# EAGLE design LED-mini35-SHIM (EAGLE 9.6.2)
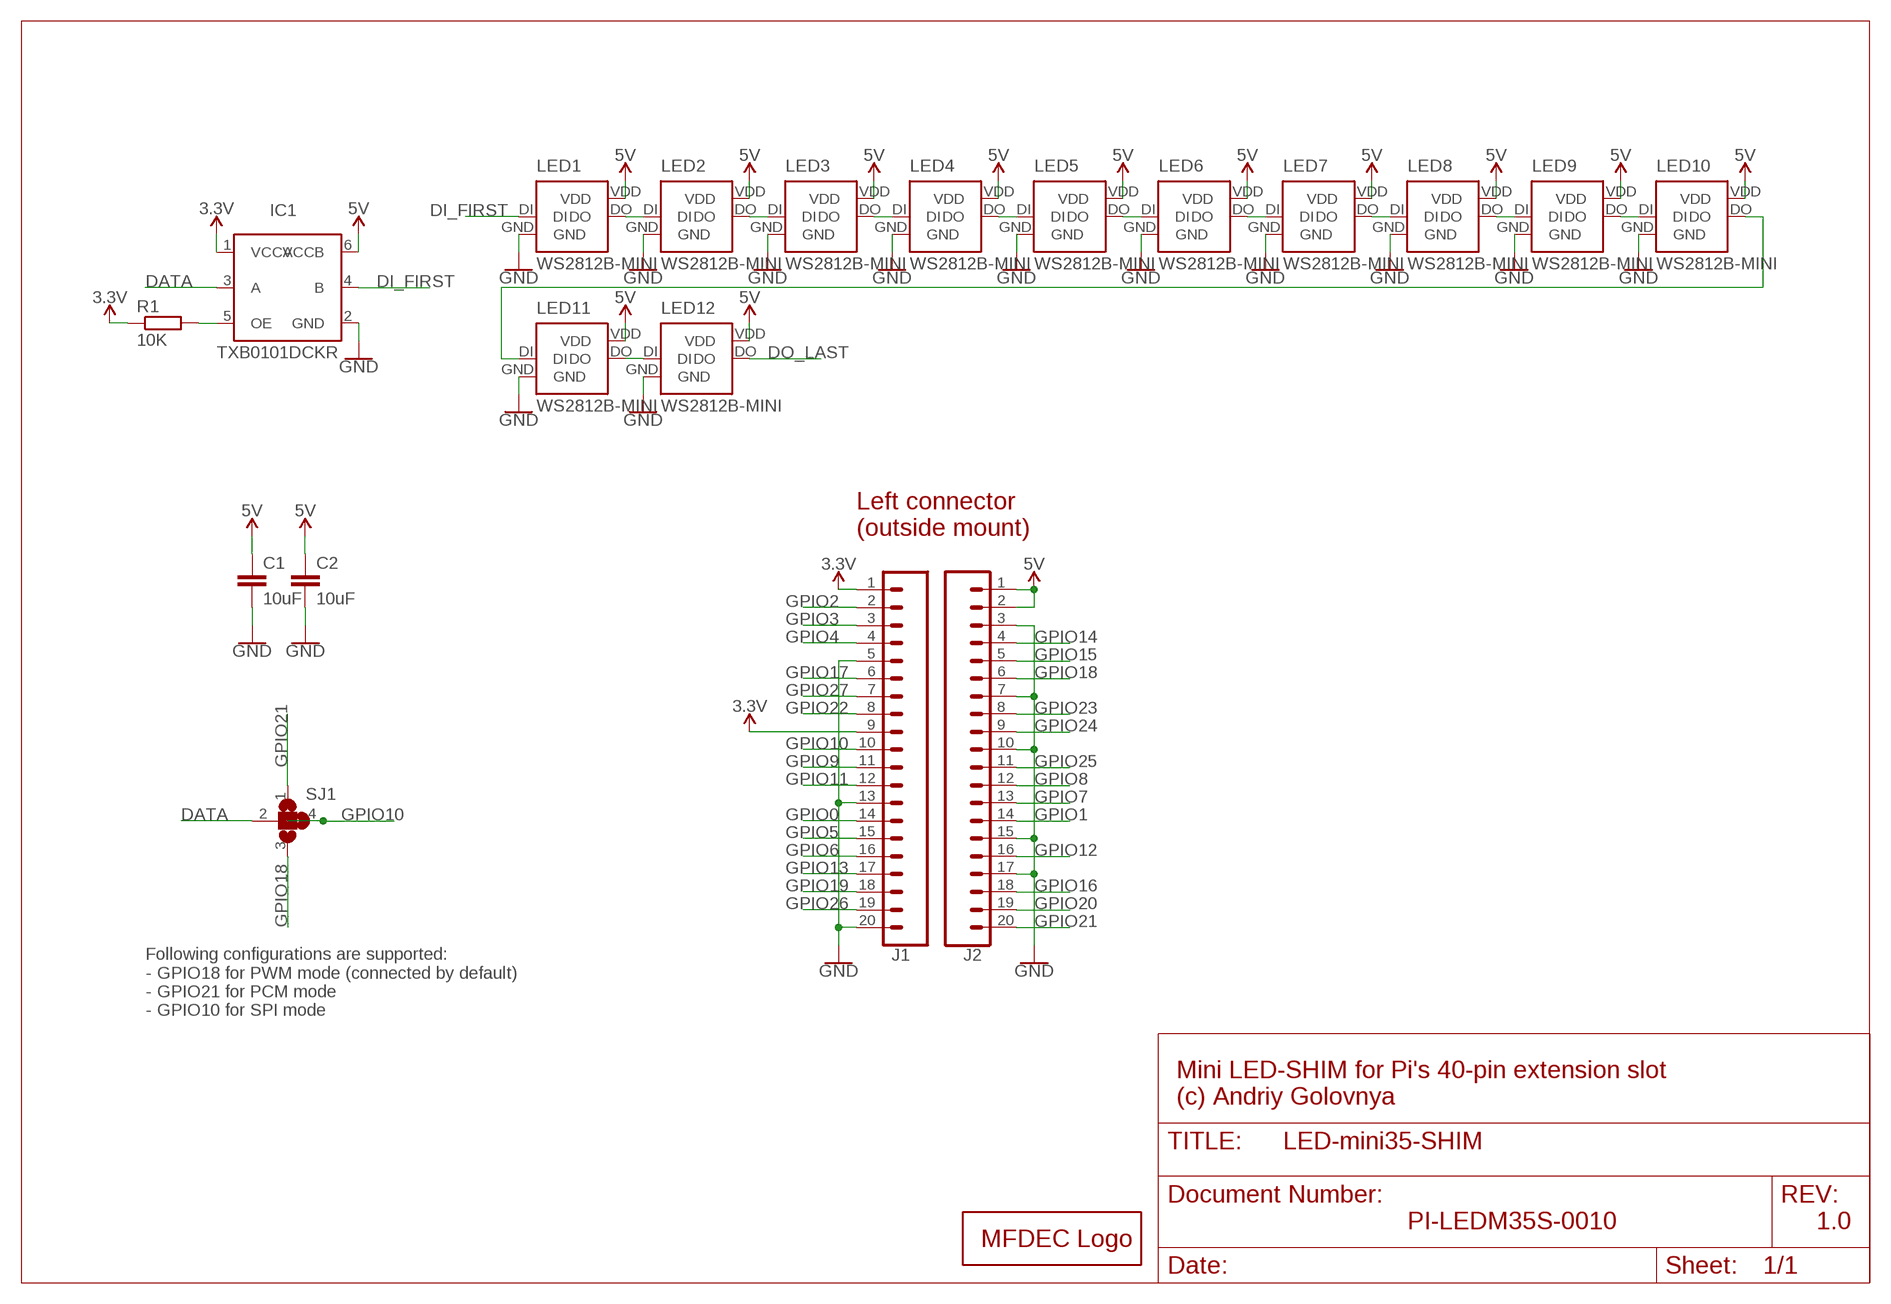
[diagram p0: schematic, sheet 1]

## Parts
C1  10uF  C-EUC0805  [C0805]
C2  10uF  C-EUC0805  [C0805]
IC1  TXB0101DCKR  [SOT65P210X110-6N]
J1  CONN_20LOCK  [1X20_LOCK]
J2  CONN_20LOCK  [1X20_LOCK]
LED1  WS2812B-MINI  [WS2812X-MINI]
LED2  WS2812B-MINI  [WS2812X-MINI]
LED3  WS2812B-MINI  [WS2812X-MINI]
LED4  WS2812B-MINI  [WS2812X-MINI]
LED5  WS2812B-MINI  [WS2812X-MINI]
LED6  WS2812B-MINI  [WS2812X-MINI]
LED7  WS2812B-MINI  [WS2812X-MINI]
LED8  WS2812B-MINI  [WS2812X-MINI]
LED9  WS2812B-MINI  [WS2812X-MINI]
LED10  WS2812B-MINI  [WS2812X-MINI]
LED11  WS2812B-MINI  [WS2812X-MINI]
LED12  WS2812B-MINI  [WS2812X-MINI]
LOGO1  MFDECLOGO_L_10MM  [MFDEC_L_10MM]
R1  10K  R-EU_R0402  [R0402]
SJ1  SJ3  [SJ_3]

## Nets
3.3V: IC1.1(VCCA) J1.1 J1.9 R1.1
5V: C1.1 C2.1 IC1.6(VCCB) J2.1 J2.2 LED1.VDD LED2.VDD LED3.VDD LED4.VDD LED5.VDD LED6.VDD LED7.VDD LED8.VDD LED9.VDD LED10.VDD LED11.VDD LED12.VDD
DATA: IC1.3(A) SJ1.2
DI_FIRST: IC1.4(B) LED1.DI
DO_LAST: LED12.DO
GND: C1.2 C2.2 IC1.2(GND) J1.5 J1.13 J1.20 J2.3 J2.7 J2.10 J2.15 J2.17 LED1.GND LED2.GND LED3.GND LED4.GND LED5.GND LED6.GND LED7.GND LED8.GND LED9.GND LED10.GND LED11.GND LED12.GND
GPIO0: J1.14
GPIO1: J2.14
GPIO2: J1.2
GPIO3: J1.3
GPIO4: J1.4
GPIO5: J1.15
GPIO6: J1.16
GPIO7: J2.13
GPIO8: J2.12
GPIO9: J1.11
GPIO10: J1.10 SJ1.4
GPIO11: J1.12
GPIO12: J2.16
GPIO13: J1.17
GPIO14: J2.4
GPIO15: J2.5
GPIO16: J2.18
GPIO17: J1.6
GPIO18: J2.6 SJ1.3
GPIO19: J1.18
GPIO20: J2.19
GPIO21: J2.20 SJ1.1
GPIO22: J1.8
GPIO23: J2.8
GPIO24: J2.9
GPIO25: J2.11
GPIO26: J1.19
GPIO27: J1.7
N$1: LED1.DO LED2.DI
N$2: LED2.DO LED3.DI
N$3: LED3.DO LED4.DI
N$4: LED4.DO LED5.DI
N$5: LED5.DO LED6.DI
N$6: LED6.DO LED7.DI
N$7: LED7.DO LED8.DI
N$8: LED8.DO LED9.DI
N$9: LED9.DO LED10.DI
N$10: LED10.DO LED11.DI
N$11: LED11.DO LED12.DI
N$143: IC1.5(OE) R1.2

## Notes on the sheet
- Left connector
  (outside mount)
- Following configurations are supported:
  - GPIO18 for PWM mode (connected by default)
  - GPIO21 for PCM mode
  - GPIO10 for SPI mode
- Mini LED-SHIM for Pi's 40-pin extension slot
  (c) Andriy Golovnya
- PI-LEDM35S-0010 | 1.0

## Library data of the parts
C1 C2 = rcl:C-EU: CAPACITOR, European symbol; SPICEPREFIX: C
IC1 = TXB0101DCKR:TXB0101DCKR
J1 J2 = _my_locked_connectors:CONN_20: Multi connection point. Often used as Generic Header-pin footprint for 0.1 inch spaced/style header connections On any of the 0.1 inch spaced packages, you can populate with these: Break Away Headers - Straight <https://www.sparkfun.com/products/116> (PRT-00116) Break Away Male Headers - Right Angle <https://www.sparkfun.com/products/553> (PRT-00553) Female Headers <https://www.sparkfun.com/products/115> (PRT-00115) Break Away Headers - Machine Pin <https://www.sparkfun.com/products/117> (PRT-00117) Break Away Female Headers - Swiss Machine Pin <https://www.sparkfun.com/products/743> (PRT-00743) For SCREWTERMINALS and SPRING TERMINALS visit here: Screw Terimnals on SparkFun.com <https://www.sparkfun.com/search/results?term=Screw+Terminals> (5mm/3.5mm/2.54mm spacing) This device is also useful as a general connection point to wire up your design to another part of your project. Our various solder wires solder well into these plated through hole pads. Hook-Up Wire - Assortment (Stranded, 22 AWG) <https://www.sparkfun.com/products/11375> (PRT-11375) Hook-Up Wire - Assortment (Solid Core, 22 AWG) <https://www.sparkfun.com/products/11367> (PRT-11367) View the entire wire category on our website here <https://www.sparkfun.com/categories/141> Special notes: Molex polarized connector foot print use with SKU : PRT-08231 with associated crimp pins and housings. 1MM SMD Version SKU: PRT-10208 NOTES ON THE VARIANTS LOCK and LOCK_LONGPADS... This footprint was designed to help hold the alignment of a through-hole component (i.e. 6-pin header) while soldering it into place. You may notice that each hole has been shifted either up or down by 0.005 of an inch from it's more standard position (which is a perfectly straight line). This slight alteration caused the pins (the squares in the middle) to touch the edges of the holes. Because they are alternating, it causes a "brace" to hold the component in place. 0.005 has proven to be the perfect amount of "off-center" position when using our standard breakaway headers. Although looks a little odd when you look at the bare footprint, once you have a header in there, the alteration is very hard to notice. Also,if you push a header all the way into place, it is covered up entirely on the bottom side. Note about LOCK SPECIAL package: This is just like the LOCK variant in that the holes are staggared by 5 mil, but except for the last two holes. They are not altered from the "standard" footprint layout. This is used for a special purpose on the layout of our Graphic LCD Backpack. Make sure you want to use this device before selecting it for you project!
LED1-LED12 = WS281X:WS2812: WS2812 RGB LED
LOGO1 = _my_logos:MFDECLOGO: Midnight Fog - Digital Eye Candy LOGO
R1 = rcl:R-EU_: RESISTOR, European symbol; SPICEPREFIX: R
SJ1 = _my_jumpers:SJ3: SMD solder JUMPER SJ3 - simple jumper SJ3FI - fancy inside jumper SJ3FO - fancy outside jumper SJ3W - wide jumper

## Board
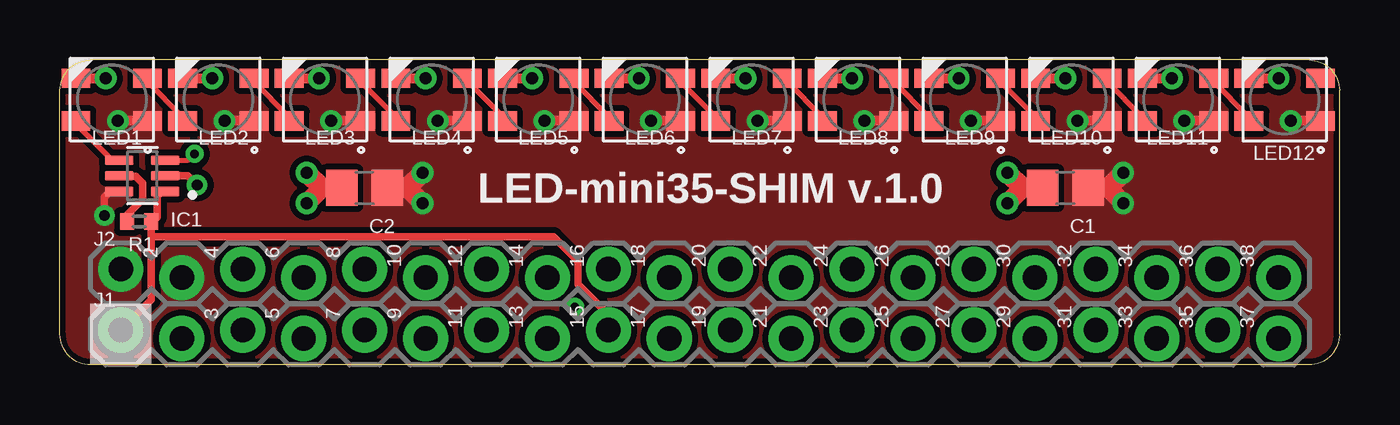
[diagram p1: board, top side]
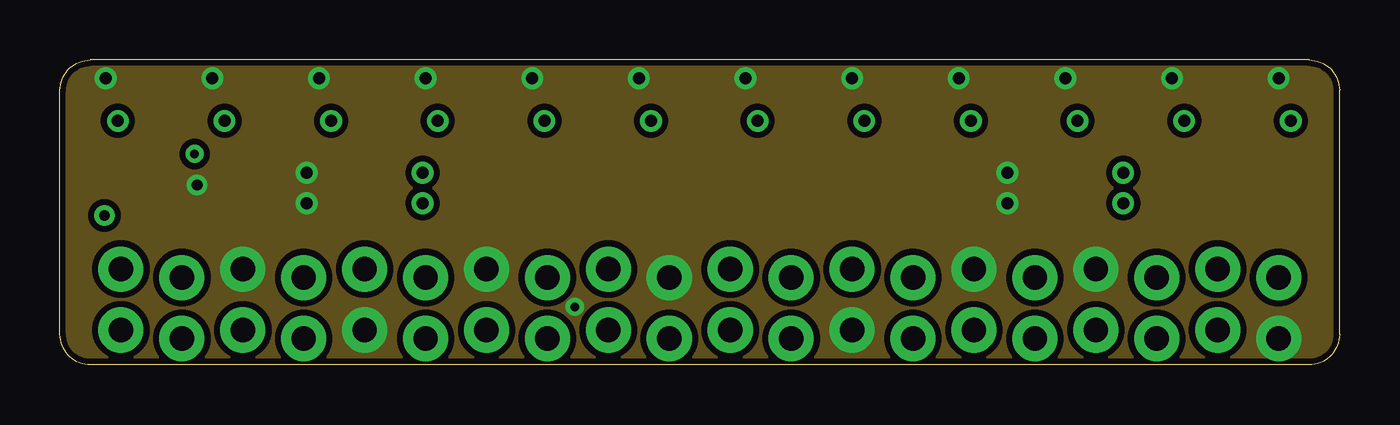
[diagram p2: board, inner layer Route2]
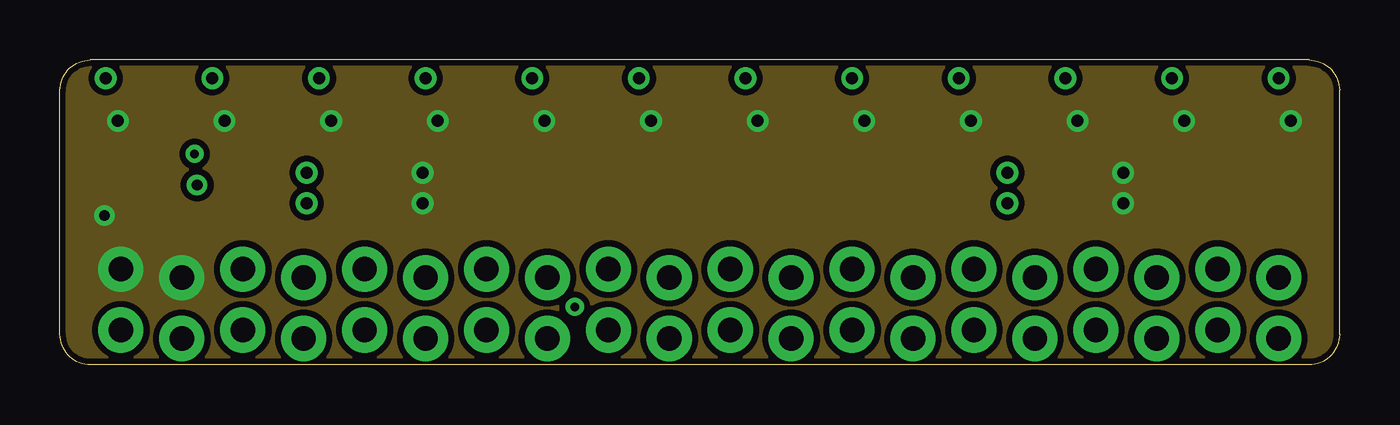
[diagram p3: board, inner layer Route15]
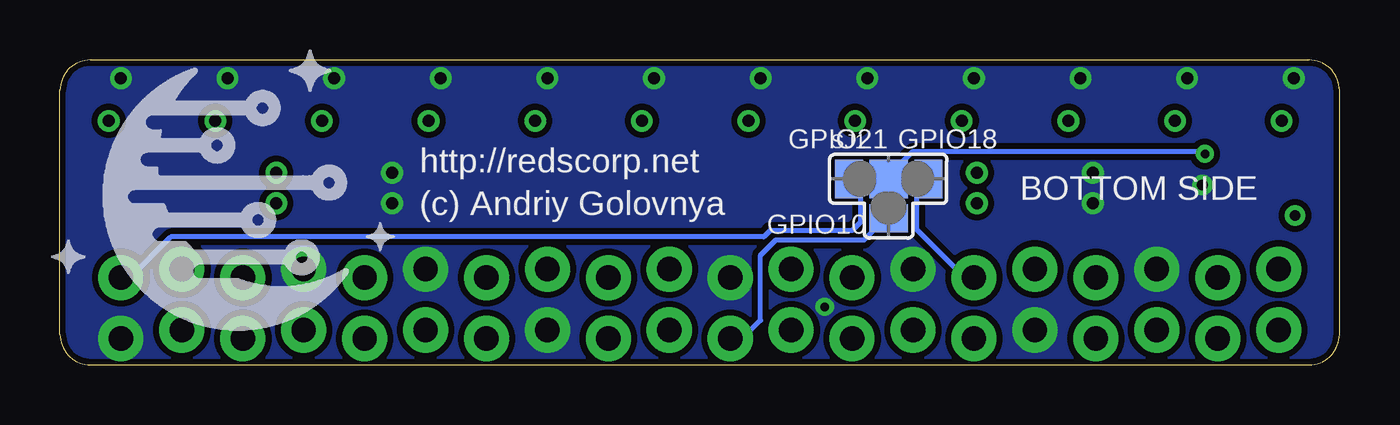
[diagram p4: board, bottom side, seen from below]

Size 53.34 x 12.7 mm. Coordinates in mm from the lower left corner, seen from the top.
Outline: 53.34,1.27 53.34,11.43 arc90 52.07,12.7 1.27,12.7 arc90 0,11.43 0,1.27 arc90 1.27,0 52.07,0 arc90 53.34,1.27
Copper layers (1+2*15+16): Top 0.035mm / dielectric 0.2mm / Route2 0.035mm / dielectric 1.5mm / Route15 0.035mm / dielectric 0.2mm / Bottom 0.035mm
Design rules "default *": minimum track width 6mil, minimum drill 0.35mm, track to track 6mil, track to pad 6mil, pad to pad 6mil, via to via 6mil, smd to smd 6mil, copper to edge 6mil, drill to drill 6mil, minimum pad ring 10mil, minimum via ring 8mil, stop-mask expansion 4mil, vias tented up to drill 20mil, thermal gap 10mil

### Footprints (pad centres in the part's own frame; a part is rotated, then mirrored left to right if it is on the bottom)
C0805 = smd 1.3 x 1.5: 1 -0.95,0; 2 0.95,0
SOT65P210X110-6N = smd 1.19 x 0.4: 1 -0.96,0.65; 2 -0.96,0; 3 -0.96,-0.65; 4 0.96,-0.65; 5 0.96,0; 6 0.96,0.65
1X20_LOCK = drill 1.016 pad 1.88: 1 0,0.178; 2 2.54,-0.178; 3 5.08,0.178; 4 7.62,-0.178; 5 10.16,0.178; 6 12.7,-0.178; 7 15.24,0.178; 8 17.78,-0.178; 9 20.32,0.178; 10 22.86,-0.178; 11 25.4,0.178; 12 27.94,-0.178; 13 30.48,0.178; 14 33.02,-0.178; 15 35.56,0.178; 16 38.1,-0.178; 17 40.64,0.178; 18 43.18,-0.178; 19 45.72,0.178; 20 48.26,-0.178
WS2812X-MINI = smd 1.2 x 0.8: DI 1.49,0.89; DO -1.49,-0.89; GND 1.49,-0.89; VDD -1.49,0.89
R0402 = smd 0.6 x 0.7: 1 -0.5,0; 2 0.5,0
SJ_3 = smd 1.168 x 1.6: 1 -1.651,0; 3 1.651,0 | smd 1.6 x 1.6: 2 0,0 | smd 1.6 x 1.168: 4 0,-1.651

### Placement (x,y rotation side)
C1  41.91,7.37 180 top
C2  12.7,7.37 180 top
IC1  3.43,7.87 180 top
J1  2.54,1.27 0 top
J2  2.54,3.81 0 top
LED1  2.16,11.05 180 top
LED2  6.6,11.05 180 top
LED3  11.05,11.05 180 top
LED4  15.49,11.05 180 top
LED5  19.94,11.05 180 top
LED6  24.38,11.05 180 top
LED7  28.83,11.05 180 top
LED8  33.27,11.05 180 top
LED9  37.72,11.05 180 top
LED10  42.16,11.05 180 top
LED11  46.61,11.05 180 top
LED12  51.05,11.05 180 top
LOGO1  54.48,0.51 0 bottom
R1  3.3,5.97 180 top
SJ1  18.8,7.75 0 bottom

### Tracks (layer width: path | path; a pad name or v marks a point on that pad's centre or on a via)
3.3V
  Top 0.305: J1.1 3.81,2.72 3.81,5.33 | 3.81,5.33 R1.1 3.88,5.97 4.06,6.15 4.06,7.02 4.26,7.22 IC1.1 | J1.9 22.86,2.08 21.59,3.35 21.59,4.32 20.57,5.33 3.81,5.33
5V  (via drill 0.45, 0.5)
  Top 0.305: v1.85,6.22 1.85,6.99 2.09,7.22 IC1.6
  Top 0.406: LED1.VDD v2.41,10.16 | LED2.VDD v6.86,10.16 | LED3.VDD v11.3,10.16 | LED4.VDD v15.75,10.16 | LED5.VDD v20.19,10.16 | LED6.VDD v24.64,10.16 | LED7.VDD v29.08,10.16 | LED8.VDD v33.53,10.16 | LED9.VDD v37.97,10.16 | LED10.VDD v42.42,10.16 | LED11.VDD v46.86,10.16 | LED12.VDD v51.31,10.16
  Top 0.813: 14.48,7.37 v15.11,6.73 | C2.1 14.48,7.37 | 14.48,7.37 v15.11,8 | 43.69,7.37 v44.32,6.73 | C1.1 43.69,7.37 | 43.69,7.37 v44.32,8
  pour Top (isolate 0.254, no thermals): -2.54,0 -2.54,12.7 53.34,12.7 53.34,0
  pour Route15 (isolate 0.254, no thermals): 0,-2.54 0,12.7 53.34,12.7 53.34,-2.54
DATA  (via drill 0.35)
  Top 0.203: IC1.3 5.35,8.52 v5.61,8.79
  Bottom 0.152: 18.8,7.87 SJ1.2
  Bottom 0.203: v5.61,8.79 5.71,8.89 17.78,8.89 18.8,7.87
DI_FIRST
  Top 0.203: LED1.DI 0.54,10.16 2.18,8.52 IC1.4
GND  (via drill 0.35, 0.45, 0.5)
  Top 0.305: v5.71,7.49 5.33,7.87 IC1.2
  Top 0.406: LED1.GND v1.9,11.94 v1.91,11.94 | LED2.GND v6.35,11.94 | LED3.GND v10.79,11.94 | LED4.GND v15.24,11.94 | LED5.GND v19.68,11.94 | LED6.GND v24.13,11.94 | LED7.GND v28.57,11.94 | LED8.GND v33.02,11.94 | LED9.GND v37.46,11.94 v37.47,11.94 | LED10.GND v41.91,11.94 | LED11.GND v46.35,11.94 | LED12.GND v50.8,11.94
  Top 0.813: 10.92,7.37 v10.29,8 | C2.2 10.92,7.37 | 10.92,7.37 v10.29,6.73 | 40.13,7.37 v39.5,8 | C1.2 40.13,7.37 | 40.13,7.37 v39.5,6.73
  other vias: 21.46,2.41
  pour Bottom (isolate 0.254, no thermals): 0,0 0,12.7 55.88,12.7 55.88,0
  pour Route2 (isolate 0.254, no thermals): 0,0 0,15.24 53.34,15.24 53.34,0
GPIO10
  Bottom 0.152: 18.92,6.1 SJ1.4
  Bottom 0.203: J1.10 24.89,1.09 24.13,1.85 24.13,4.57 23.5,5.21 19.81,5.21 18.92,6.1
GPIO18
  Bottom 0.152: SJ1.3 18.4,7.75
  Bottom 0.203: J2.6 15.62,3.63 17.63,5.64 17.63,7.26 SJ1.3
GPIO21
  Bottom 0.152: SJ1.1 20.45,7.62
  Bottom 0.203: 20.45,7.62 19.96,7.14 19.96,5.94 20.32,5.59 23.75,5.59 24,5.33 48.72,5.33 50.42,3.63 J2.20
N$1
  Top 0.203: LED1.DO 3.65,11.79 5.11,10.32 LED2.DI
N$2
  Top 0.203: LED2.DO 8.09,11.79 9.56,10.32 LED3.DI
N$3
  Top 0.203: LED3.DO 12.54,11.79 14,10.32 LED4.DI
N$4
  Top 0.203: LED4.DO 16.98,11.81 18.45,10.35 LED5.DI
N$5
  Top 0.203: LED5.DO 21.43,11.79 22.89,10.32 LED6.DI
N$6
  Top 0.203: LED6.DO 25.87,11.79 27.34,10.32 LED7.DI
N$7
  Top 0.203: LED7.DO 30.32,11.79 31.78,10.32 LED8.DI
N$8
  Top 0.203: LED8.DO 34.76,11.79 36.23,10.32 LED9.DI
N$9
  Top 0.203: LED9.DO 39.21,11.79 40.67,10.32 LED10.DI
N$10
  Top 0.203: LED10.DO 43.65,11.79 45.12,10.32 LED11.DI
N$11
  Top 0.203: LED11.DO 48.1,11.79 49.56,10.32 LED12.DI
N$143
  Top 0.305: IC1.5 2.49,7.86 3.16,7.86 3.44,7.57 3.44,6.89 2.8,6.25 R1.2

### Text on the board
tPlace: LED-mini35-SHIM v.1.0 | 2 | 4 | 6 | 8 | 10 | 12 | 14 | 16 | 18 | 20 | 22 | 24 | 26 | 28 | 30 | 32 | 34 | 36 | 38 | 3 | 5 | 7 | 9 | 11 | 13 | 15 | 17 | 19 | 21 | 23 | 25 | 27 | 29 | 31 | 33 | 35 | 37
bPlace: GPIO18 | GPIO21 | http://redscorp.net | BOTTOM SIDE | (c) Andriy Golovnya | GPIO10